# Altium schematic sheet Ethernet модуль.SchDoc
size 209 x 297 mm; DocumentNumber: 11; SheetNumber: 11; SheetTotal: 11; ListNumber: 1
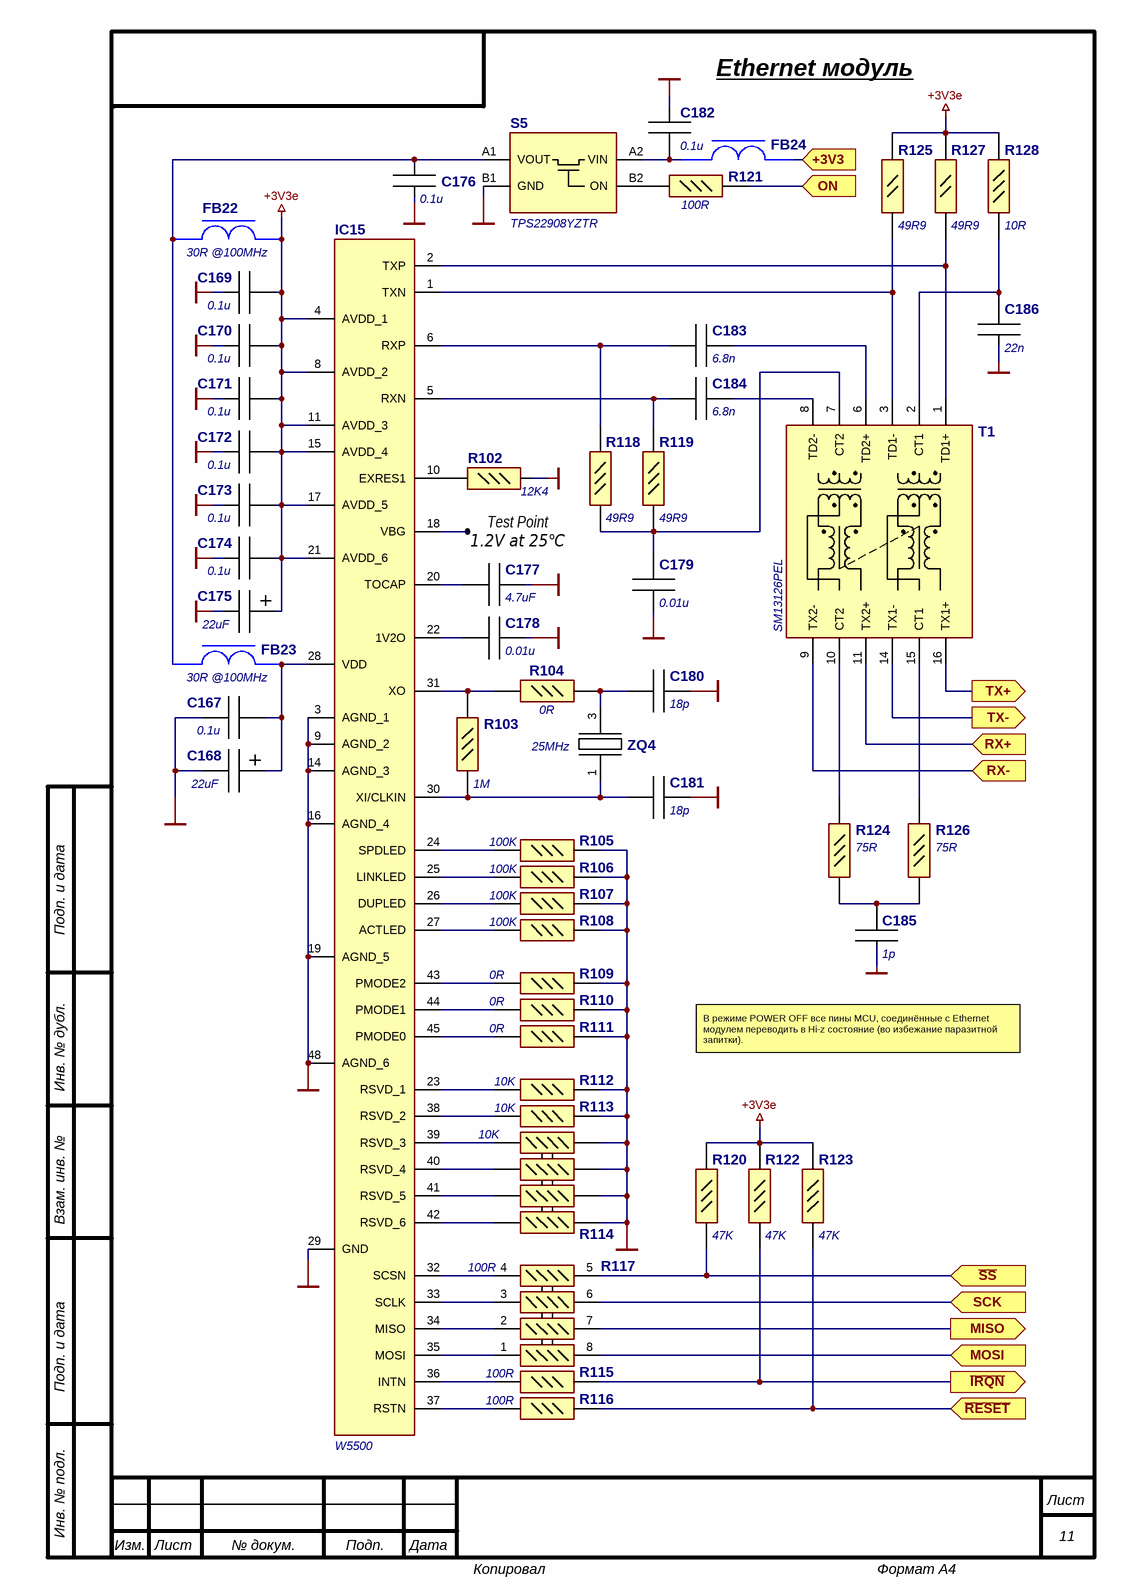
[diagram p0: Ethernet модуль.SchDoc]

## Parts
C167  0.1u  [:CAP0402 100x50x50]
C168  22uF  [:CAP1206 C3216-18]
C169  0.1u  [:CAP0402 100x50x50]
C170  0.1u  [:CAP0402 100x50x50]
C171  0.1u  [:CAP0402 100x50x50]
C172  0.1u  [:CAP0402 100x50x50]
C173  0.1u  [:CAP0402 100x50x50]
C174  0.1u  [:CAP0402 100x50x50]
C175  22uF  [:CAP1206 C3216-18]
C176  0.1u  [:CAP0402 100x50x50]
C177  4.7uF  [:CAP0805 C2012X125]
C178  0.01u  [:CAP0402 100x50x50]
C179  0.01u  [:CAP0402 100x50x50]
C180  18p  [:CAP0402 100x50x50]
C181  18p  [:CAP0402 100x50x50]
C182  0.1u  [:CAP0402 100x50x50]
C183  6.8n  [:CAP0402 100x50x50]
C184  6.8n  [:CAP0402 100x50x50]
C185  1p  [:CAP0402 100x50x50]
C186  22n  [:CAP0402 100x50x50]
FB22  30R @100MHz  [:FER BLM18SP300SN1D]
FB23  30R @100MHz  [:FER BLM18SP300SN1D]
FB24  30R @100MHz  [:FER BLM18SP300SN1D]  (value not drawn)
IC15  W5500  [:QFP48 P900X900X160-48N]
R102  Manufacturer_Part_Number (part 2: value): 12K4  [:RES0402]  (hidden comment: RC0402FR-07)
R103  Manufacturer_Part_Number (part 2: value): 1M  [:RES0402]  (hidden comment: RC0402FR-07)
R104  Manufacturer_Part_Number (part 2: value): 0R  [:RES0402]  (hidden comment: RC0402FR-07)
R105  Manufacturer_Part_Number (part 2: value): 100K  [:RES0402]  (hidden comment: RC0402FR-07)
R106  Manufacturer_Part_Number (part 2: value): 100K  [:RES0402]  (hidden comment: RC0402FR-07)
R107  Manufacturer_Part_Number (part 2: value): 100K  [:RES0402]  (hidden comment: RC0402FR-07)
R108  Manufacturer_Part_Number (part 2: value): 100K  [:RES0402]  (hidden comment: RC0402FR-07)
R109  Manufacturer_Part_Number (part 2: value): 0R  [:RES0402]  (hidden comment: RC0402FR-07)
R110  Manufacturer_Part_Number (part 2: value): 0R  [:RES0402]  (hidden comment: RC0402FR-07)
R111  Manufacturer_Part_Number (part 2: value): 0R  [:RES0402]  (hidden comment: RC0402FR-07)
R112  Manufacturer_Part_Number (part 2: value): 10K  [:RES0402]  (hidden comment: RC0402FR-07)
R113  Manufacturer_Part_Number (part 2: value): 10K  [:RES0402]  (hidden comment: RC0402FR-07)
R114  10K  [:RES0402x4]
R115  Manufacturer_Part_Number (part 2: value): 100R  [:RES0402]  (hidden comment: RC0402FR-07)
R116  Manufacturer_Part_Number (part 2: value): 100R  [:RES0402]  (hidden comment: RC0402FR-07)
R117  100R  [:RES0402x4]
R118  Manufacturer_Part_Number (part 2: value): 49R9  [:RES0402]  (hidden comment: RC0402FR-07)
R119  Manufacturer_Part_Number (part 2: value): 49R9  [:RES0402]  (hidden comment: RC0402FR-07)
R120  Manufacturer_Part_Number (part 2: value): 47K  [:RES0402]  (hidden comment: RC0402FR-07)
R121  Manufacturer_Part_Number (part 2: value): 100R  [:RES0402]  (hidden comment: RC0402FR-07)
R122  Manufacturer_Part_Number (part 2: value): 47K  [:RES0402]  (hidden comment: RC0402FR-07)
R123  Manufacturer_Part_Number (part 2: value): 47K  [:RES0402]  (hidden comment: RC0402FR-07)
R124  Manufacturer_Part_Number (part 2: value): 75R  [:RES0402]  (hidden comment: RC0402FR-07)
R125  49R9  [:RES0805]
R126  Manufacturer_Part_Number (part 2: value): 75R  [:RES0402]  (hidden comment: RC0402FR-07)
R127  49R9  [:RES0805]
R128  Manufacturer_Part_Number (part 2: value): 10R  [:RES0402]  (hidden comment: RC0402FR-07)
S5  TPS22908YZTR  [:BGA4 P90X90X50]
T1  SM13126PEL  [:TRAN SM13126PEL]
X3  Big Circle Pad  (value not drawn)
ZQ4  25MHz  [:RESO SXT22418FB48-25.000MT]

## Ports
+3V3 (in), MISO (out), MOSI (in), ON (in), RX+ (in), RX- (in), SCK (in), TX+ (out), TX- (out), ~{IRQN} (out), ~{RESET} (in), ~{SS} (in)

## Nets
+3V3e: C169.2 C170.2 C171.2 C172.2 C173.2 C174.2 C175.1(+) FB22.2 IC15.4(AVDD_1) IC15.8(AVDD_2) IC15.11(AVDD_3) IC15.15(AVDD_4) IC15.17(AVDD_5) IC15.21(AVDD_6) R120.2 R122.2 R123.2 R125.2 R127.2 R128.2
GND: C167.1 C168.2 C169.1 C170.1 C171.1 C172.1 C173.1 C174.1 C175.2 C176.2 C177.2 C178.2 C179.1 C180.2 C181.2 C182.2 C185.2 C186.1 IC15.3(AGND_1) IC15.9(AGND_2) IC15.14(AGND_3) IC15.16(AGND_4) IC15.19(AGND_5) IC15.29(GND) IC15.48(AGND_6) R102.2 R105.2 R106.2 R107.2 R108.2 R109.2 R110.2 R111.2 R112.1 R113.1 R114.5 R114.6 R114.7 R114.8 S5.B1(GND)
+3V3: FB24.2 ; port +3V3
~{IRQN}: R115.2 R122.1 ; port ~{IRQN}
MISO: R117.7 ; port MISO
MOSI: R117.8 ; port MOSI
ON: R121.2 ; port ON
~{RESET}: R116.2 R123.1 ; port ~{RESET}
RX+: T1.11(TX2+) ; port RX+
RX-: T1.9(TX2-) ; port RX-
~{SS}: R117.5 R120.1 ; port ~{SS}
SCK: R117.6 ; port SCK
TX+: T1.16(TX1+) ; port TX+
TX-: T1.14(TX1-) ; port TX-
NetC167_2: C167.2 C168.1(+) FB23.2 IC15.28(VDD)
NetC176_1: C176.1 FB22.1 FB23.1 S5.A1(VOUT)
NetC177_1: C177.1 IC15.20(TOCAP)
NetC178_1: C178.1 IC15.22(1V2O)
NetC179_2: C179.2 R118.1 R119.1 T1.7(CT2)
NetC180_1: C180.1 R104.2 ZQ4.3
NetC181_1: C181.1 IC15.30(XI/CLKIN) R103.1 ZQ4.1
NetC182_1: C182.1 FB24.1 S5.A2(VIN)
NetC183_1: C183.1 IC15.6(RXP) R118.2
NetC183_2: C183.2 T1.6(TD2+)
NetC184_1: C184.1 IC15.5(RXN) R119.2
NetC184_2: C184.2 T1.8(TD2-)
NetC185_1: C185.1 R124.2 R126.2
NetC186_2: C186.2 R128.1 T1.2(CT1)
NetIC15_1: IC15.1(TXN) R125.1 T1.3(TD1-)
NetIC15_2: IC15.2(TXP) R127.1 T1.1(TD1+)
NetIC15_10: IC15.10(EXRES1) R102.1
NetIC15_18: IC15.18(VBG) X3.1
NetIC15_23: IC15.23(RSVD_1) R112.2
NetIC15_24: IC15.24(SPDLED) R105.1
NetIC15_25: IC15.25(LINKLED) R106.1
NetIC15_26: IC15.26(DUPLED) R107.1
NetIC15_27: IC15.27(ACTLED) R108.1
NetIC15_31: IC15.31(XO) R103.2 R104.1
NetIC15_32: IC15.32(SCSN) R117.4
NetIC15_33: IC15.33(SCLK) R117.3
NetIC15_34: IC15.34(MISO) R117.2
NetIC15_35: IC15.35(MOSI) R117.1
NetIC15_36: IC15.36(INTN) R115.1
NetIC15_37: IC15.37(RSTN) R116.1
NetIC15_38: IC15.38(RSVD_2) R113.2
NetIC15_39: IC15.39(RSVD_3) R114.4
NetIC15_40: IC15.40(RSVD_4) R114.3
NetIC15_41: IC15.41(RSVD_5) R114.2
NetIC15_42: IC15.42(RSVD_6) R114.1
NetIC15_43: IC15.43(PMODE2) R109.1
NetIC15_44: IC15.44(PMODE1) R110.1
NetIC15_45: IC15.45(PMODE0) R111.1
NetR121_1: R121.1 S5.B2(ON)
NetR124_1: R124.1 T1.10(CT2)
NetR126_1: R126.1 T1.15(CT1)

## Notes on the sheet
- (near C182) Ethernet модуль
- (near X3) Test Point
  1.2V at 25℃
- В режиме POWER OFF все пины MCU, соединённые с Ethernet модулем переводить в Hi-z состояние (во избежание паразитной запитки).
- Подп. и дата
- Инв. № дубл.
- Взам. инв. №
- Инв. № подл.
- Лист
- Изм.
- № докум.
- Подп.
- Дата
- Копировал
- Формат А4

## Library data of the parts
C167 C169-C174 C176 C182 = GRM155R71E104KE14J: ±10% 25V Ceramic Capacitor X7R 0402 (1005 Metric); Manufacturer_Name: Murata Electronics; Short Description: 0402 0.1uF 25V; Datasheet Link: http://www.murata.com/~/media/webrenewal/support/library/catalog/products/capacitor/mlcc/c02e.pdf; Height: 0.55mm; Manufacturer_Part_Number: GRM155R71E104KE14J; Mouser Part Number: 81-GRM155R71E104KE4J; Mouser Price/Stock: https://www.mouser.co.uk/ProductDetail/Murata-Electronics/GRM155R71E104KE14J?qs=hNud%2FORuBR2EQtvG2InwAQ%3D%3D; Arrow Part Number: GRM155R71E104KE14J; Arrow Price/Stock: https://www.arrow.com/en/products/grm155r71e104ke14j/murata-manufacturing
C168 C175 = TPSA226K006R0300: 22µF Molded Tantalum Capacitors 6.3V 1206 (3216 Metric) 300mOhm @ 100kHz; Manufacturer_Name: AVX; Short Description: 1206 22uF 6V3; Manufacturer_Part_Number: TPSA226K006R0300
C177 = GRM21BZ71E475KE15L: CAP CER 4.7uF 25V X7R 0805; Manufacturer_Name: Murata Electronics; Short Description: 0805 4.7uF 25V; Datasheet Link: https://search.murata.co.jp/Ceramy/image/img/A01X/G101/ENG/GRM21BZ71E475KE15-01.pdf; Height: 1.45mm; Manufacturer_Part_Number: GRM21BZ71E475KE15L
C178 C179 = GRM1555CYA103JE01D: ±5% 35V Ceramic Capacitor C0G, NP0 0402 (1005 Metric); Manufacturer_Name: Murata Electronics; Short Description: 0402 0.01u 35V; Datasheet Link: https://search.murata.co.jp/Ceramy/image/img/A01X/G101/ENG/GRM1555CYA103JE01-01A.pdf; Height: 0.55mm; Manufacturer_Part_Number: GRM1555CYA103JE01D
C180 C181 = GJM1555C1H180JB01D: CAP CER  50V C0G/NP0 0402; Manufacturer_Name: Murata Electronics; Short Description: 0402 18p 50V; Manufacturer_Part_Number: GJM1555C1H180JB01D
C183 C184 = GCM155R71E682KA37D: CAP CER  25V X7R 0402; Manufacturer_Name: Murata Electronics; Short Description: 0402 6.8n 25V; Manufacturer_Part_Number: GCM155R71E682KA37D
C185 = GJM1555C1H1R0BB01D: CAP CER  50V C0G/NP0 0402; Manufacturer_Name: Murata Electronics; Short Description: 0402 1p 50V; Manufacturer_Part_Number: GJM1555C1H1R0BB01D
C186 = GCM155R71E223KA55D: CAP CER  25V X7R 0402; Manufacturer_Name: Murata Electronics; Short Description: 0402 22n 25V; Manufacturer_Part_Number: GCM155R71E223KA55D
FB22-FB24 = BLM18SP300SN1D: 30 Ohms @ 100MHz 1 Power Line Ferrite Bead 0603 (1608 Metric) 6A 8mOhm; Manufacturer_Name: Murata Electronics; Short Description: 0603 30R @100MHz; Datasheet Link: http://www.murata.com/~/media/webrenewal/support/library/catalog/products/emc/emifil/c31e.ashx?la=en-gb; Height: 0.95mm; Manufacturer_Part_Number: BLM18SP300SN1D; Mouser Part Number: 81-BLM18SP300SN1D; Mouser Price/Stock: https://www.mouser.co.uk/ProductDetail/Murata-Electronics/BLM18SP300SN1D/?qs=W%2FMpXkg%252BdQ4o%252BOP%252B6m8FYA%3D%3D
IC15 = W5500: Ethernet ICs 3in1 Enet Controller TCP/IP +MAC+PHY; Manufacturer_Name: Wiznet Technology; Datasheet Link: https://www.arrow.com/en/products/w5500/wiznet; Height: 1.6mm; Manufacturer_Part_Number: W5500; Arrow Part Number: W5500; Arrow Price/Stock: https://www.arrow.com/en/products/w5500/wiznet
R102-R113 R115 R116 R118-R124 R126 R128 = RC0402FR-07: Resistor 0402 1% 1/16W / Value Range: 1Ω ... 10 MΩ / Value Example: / 0R = 0Ω / 97R6 = 97.6Ω / 9K76 = 9760Ω / 1M = 1,000,000Ω; Manufacturer_Name: YAGEO; Manufacturer_Part_Number (part 3: after value): L; Short Description: 0402 1%; Datasheet Link: http://www.yageo.com/documents/recent/PYu-RC0402_51_RoHS_L_6_r.pdf; Height: 0.4mm; Manufacturer_Part_Number: RC0402FR-07; Parameter 1: *
R114 = EXB-N8V103JX: 10 kOhm ±5% 31mW Power Per Element Isolated 4 Resistor Network/Array ±200ppm/°C 0804, Concave, Long Side Terminals; Manufacturer_Name: Panasonic; Short Description: 0804 5% 10k; Datasheet Link: https://industrial.panasonic.com/cdbs/www-data/pdf/AOC0000/AOC0000C14.pdf; Height: 0.55mm; Manufacturer_Part_Number: EXB-N8V103JX
R117 = EXB-N8V101JX: 100 Ohm ±5% 31mW Power Per Element Isolated 4 Resistor Network/Array ±200ppm/°C 0804, Concave, Long Side Terminals; Manufacturer_Name: Panasonic; Short Description: 0804 5% 100R; Datasheet Link: https://industrial.panasonic.com/cdbs/www-data/pdf/AOC0000/AOC0000C14.pdf; Height: 0.55mm; Manufacturer_Part_Number: EXB-N8V101JX; Mouser Part Number: 667-EXB-N8V101JX; Mouser Price/Stock: https://www.mouser.co.uk/ProductDetail/Panasonic/EXB-N8V101JX?qs=cttFivMKqWxyXyoXALoehw%3D%3D; Arrow Part Number: EXB-N8V101JX; Arrow Price/Stock: https://www.arrow.com/en/products/exbn8v101jx/panasonic
R125 R127 = ERJ-6ENF49R9V: 49.9 Ohms ±1% 0.125W, 1/8W Chip Resistor 0805 (2012 Metric) Automotive AEC-Q200 Thick Film; Manufacturer_Name: Panasonic; Datasheet Link: https://industrial.panasonic.com/cdbs/www-data/pdf/RDA0000/AOA0000C84.pdf; Height: 0.7mm; Manufacturer_Part_Number: ERJ-6ENF49R9V; Mouser Part Number: 667-ERJ-6ENF49R9V; Mouser Price/Stock: https://www.mouser.co.uk/ProductDetail/Panasonic/ERJ-6ENF49R9V?qs=qCGL2%252BBFAqUwh1urNYOtNA%3D%3D; Arrow Part Number: ERJ-6ENF49R9V; Arrow Price/Stock: https://www.arrow.com/en/products/erj-6enf49r9v/panasonic
S5 = TPS22908YZTR: SPST Switch 3.6-V, 1-A, 28-mΩ; Manufacturer_Name: Texas Instruments; Datasheet Link: http://www.ti.com/lit/gpn/tps22908; Height: 0.625mm; Manufacturer_Part_Number: TPS22908YZTR; Mouser Part Number: 595-TPS22908YZTR; Mouser Price/Stock: https://www.mouser.co.uk/ProductDetail/Texas-Instruments/TPS22908YZTR?qs=4whTb%2F0XQMjgQyC%252BYmbgaA%3D%3D; Arrow Part Number: TPS22908YZTR; Arrow Price/Stock: https://www.arrow.com/en/products/tps22908yztr/texas-instruments
T1 = SM13126PEL: Transformers LAN 10/100 BASE-T; Manufacturer_Name: Bourns; Datasheet Link: https://componentsearchengine.com/Datasheets/1/SM13126PEL.pdf; Height: 6.15mm; Manufacturer_Part_Number: SM13126PEL; Mouser Part Number: 652-SM13126PEL; Mouser Price/Stock: https://www.mouser.co.uk/ProductDetail/Bourns/SM13126PEL?qs=T3oQrply3y%252BgoqE984ONrg%3D%3D; Arrow Part Number: SM13126PEL; Arrow Price/Stock: https://www.arrow.com/en/products/sm13126pel/bourns
X3 = Big Circle Pad: Большая круглая контактная площадка
ZQ4 = SXT22418FB48-25.000MT: CRYSTAL 25MHz / ±10ppm Crystal 18pF 4-SMD / ESR: 80 Ohms; Manufacturer_Name: Suntsu Electronics, Inc.; Manufacturer_Part_Number: SXT22418FB48-25.000MT; Short Description: 25MHz